# EasyEDA Pro project High Pass Filter.eprj

# Schematic Schematic1
Create Date: 2024-03-29; Page Name: P1; Project Name: High Pass Filter; Schematic Name: Schematic1; Update Date: 2024-03-29; Company: EasyEDA.com; Drawn: EasyEDA; Page Size: A4; Part Number: JLCPCB-002; Reviewed: EasyEDA; Version: V0.1
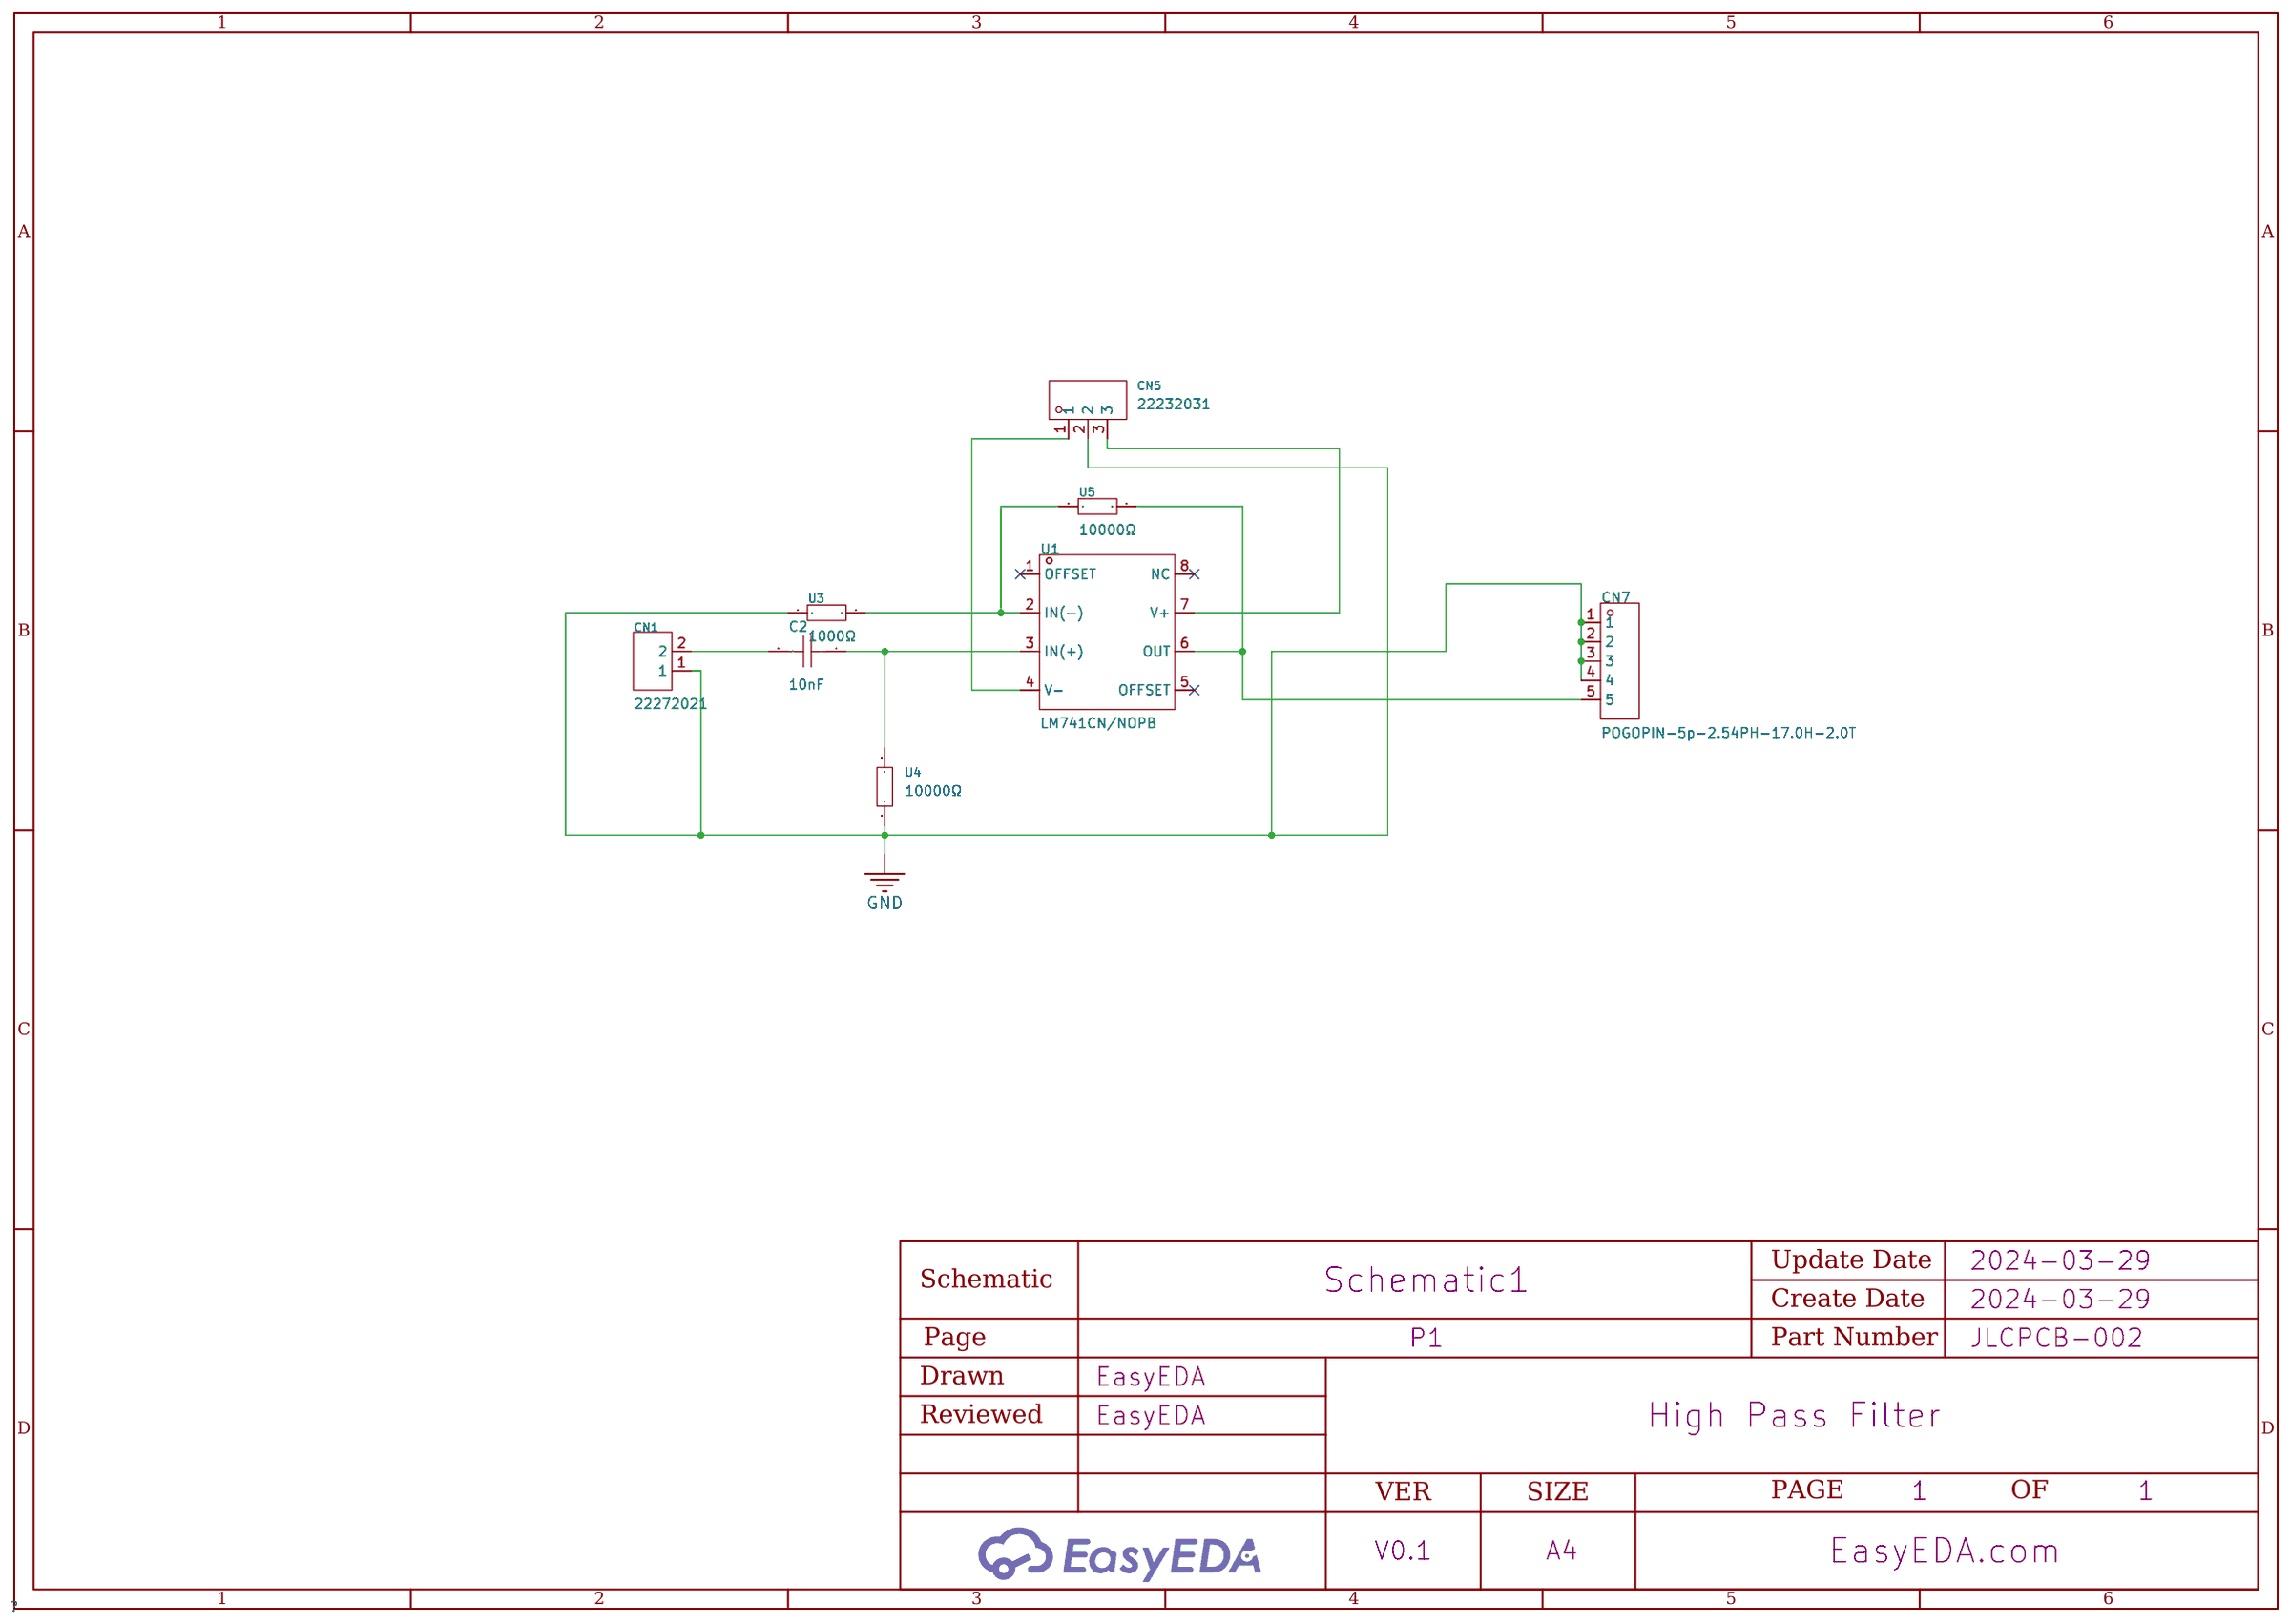
[diagram p0: schematic sheet]

## Parts
C2  10nF  [C0603]
CN1  22272021  [CONN-TH_22272021]
CN5  22232031  [CONN-TH_3P-P2.54_22-23-2031]
CN7  POGOPIN-5p-2.54PH-17.0H-2.0T  [CONN-TH_5P-P2.54_POGOPIN-5P-2.54P]
U1  LM741CN/NOPB  [DIP-8_L9.8-W6.6-P2.54-LS7.6-BL]
U3  1000Ω  [RES-TH_BD3.5-L9.0-P13.00-D0.8]
U4  10000Ω  [RES-TH_BD3.5-L9.0-P13.00-D0.8]
U5  10000Ω  [RES-TH_BD3.5-L9.0-P13.00-D0.8]

## Library data of the parts
C2 = CAP_0603: Supplier Footprint: 0603
CN1 = 22272021: Pins Structure:1x2P Pitch:2.54mm Mounting Style:- Reference Series:- Number of Pins:2P Number of Rows:1 Number of PINs Per Row:2 Row Spacing:- Contact Material:Brass; Supplier Part: C293316; Manufacturer: MOLEX; Supplier Footprint: 插件,P=2.54mm; JLCPCB Part Class: Extended Part; Datasheet: https://atta.szlcsc.com/upload/public/pdf/source/20191223/C471416_BE98D00507934E9FC983B4A2C0217E79.pdf; Supplier: LCSC; Pins Structure: 1x2P; Pitch: 2.54mm; Number of Pins: 2P; Number of Rows: 1; Number of PINs Per Row: 2; Contact Material: Brass
CN5 = 22232031: Pins Structure:1x3P Pitch:2.54mm Mounting Style:- Reference Series:- Number of Pins:3P Number of Rows:1 Number of PINs Per Row:3 Row Spacing:- Contact Material:Brass; LCSC Part Name: 1x3P 间距:2.54mm; Supplier Part: C234181; Manufacturer: MOLEX; Supplier Footprint: 插件,P=2.54mm; JLCPCB Part Class: Extended Part; Datasheet: https://atta.szlcsc.com/upload/public/pdf/source/20200109/C114123_E56320BB7CC6463DA76851D6284C5DE6.pdf; Supplier: LCSC; Pins Structure: 1x3P; Pitch: 2.54mm; Number of Pins: 3P; Number of Rows: 1; Number of PINs Per Row: 3; Contact Material: Brass
CN7 = POGOPIN-5p-2.54PH-17.0H-2.0T: Supplier Part: C9900021779; Supplier Footprint: 5p-2.54PH-17.0H-2.0T; JLCPCB Part Class: Extended Part; Supplier: LCSC
U1 = LM741CN/NOPB: Number of Circuits:单路 Gain Bandwidth Product(GBP):1.5MHz Current - Input Bias(Ib):80nA Slew Rate(SR):0.5V/us Output Current:25mA -3db Bandwidth:- Supply Current:1.5mA Operating Temperature:0℃~+70℃ Operating Temperature:0℃~+70℃; Supplier Part: C13974; Manufacturer: TI(德州仪器); Supplier Footprint: DIP-8; JLCPCB Part Class: Extended Part; Datasheet: https://www.ti.com/cn/lit/gpn/lm741; Supplier: LCSC; Number of Circuits: 单路; Gain Bandwidth Product(GBP): 1.5MHz; Current - Input Bias(Ib): 80nA; Slew Rate(SR): 0.5V/us; Output Current: 25mA; Supply Current: 1.5mA; Operating Temperature: 0℃~+70℃
U3-U5 = FR1WS-5.1Ω±5%: Type:Safety Resistor Resistance: Tolerance:±5% Tolerance:±5% Power(Watts):1W; LCSC Part Name: 5.1Ω ±5% 1W 保险电阻; Supplier Part: C145949; Manufacturer: CCO(千志电子); Supplier Footprint: 插件; JLCPCB Part Class: Extended Part; Datasheet: https://atta.szlcsc.com/upload/public/pdf/source/20171116/C145952_15108222006741123857.pdf; Supplier: LCSC; Type: Safety Resistor; Tolerance: ±5%; Power(Watts): 1W

## Nets
GND: CN1.1 CN5.2 CN7.1 CN7.2 CN7.3 CN7.4 U3.1 U4.1
$1N1586: C2.2 CN1.2
$1N1699: C2.1 U1.3(IN(+)) U4.2
$1N1709: CN5.1 U1.4(V-)
$1N1747: CN5.3 U1.7(V+)
$1N1782: U1.2(IN(-)) U3.2 U5.1
$1N2183: CN7.5 U1.6(OUT) U5.2

Not connected (* = marked no-connect by the designer): U1 1(OFFSET)* 5(OFFSET)* 8(NC)*

# Board PCB1
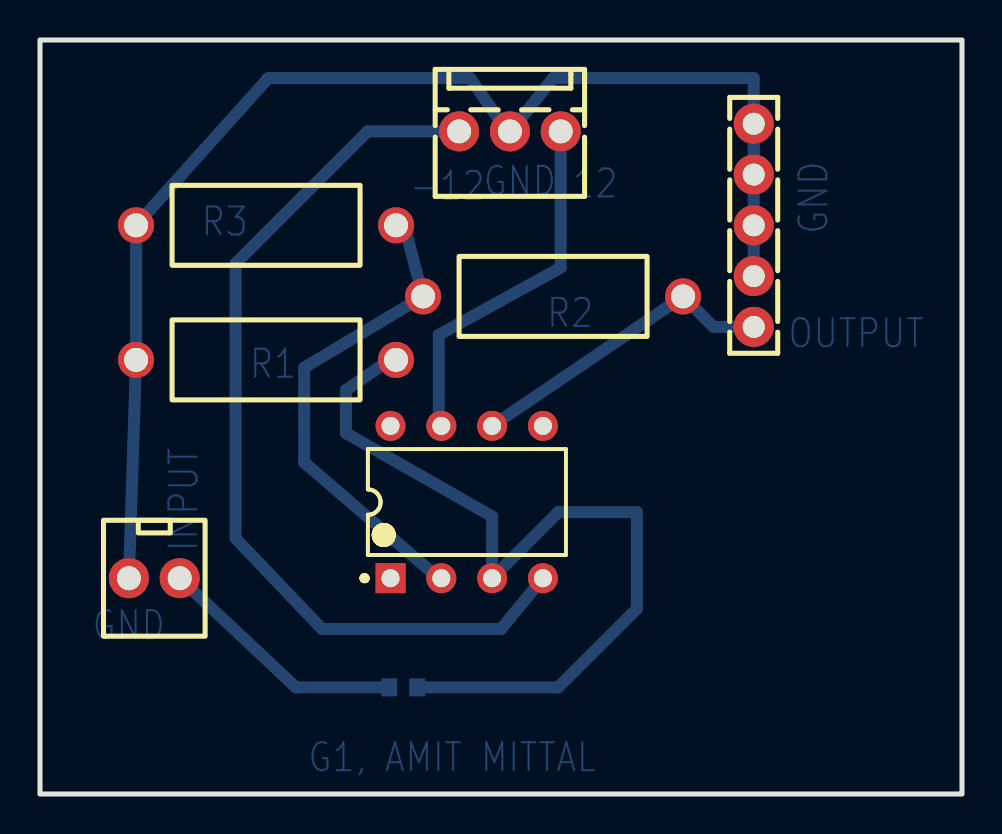
[diagram p1: board, top side]
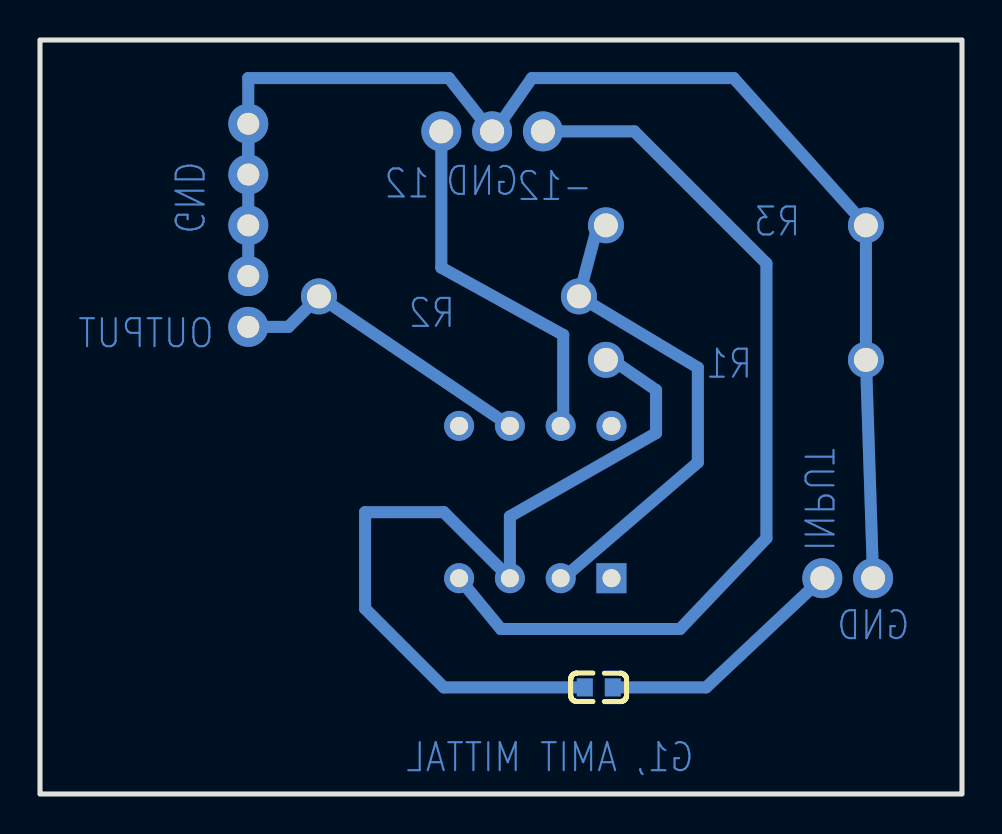
[diagram p2: board, bottom side, seen from below]

Outline 46.1 x 37.72 mm; copper layers: Top Layer, Bottom Layer. Coordinates in mm from the lower left corner of the outline.
Outline path: rectangle 0,37.72 46.1,0
Stack: Top Layer 0.035mm / Dielectric1 1.51mm FR4 er 4.5 / Bottom Layer 0.035mm

## Design rules (mm)
template: JLCPCB Capability(Two Layers Board)
spacing copperThickness1oz (default): track to track 0.102, other pairs 0.152 to 0.3
spacing copperThickness2oz: track to track 0.203, other pairs 0.152 to 0.3
track width copperThickness1oz (default): min 0.127, default 0.254, max 2.54
track width copperThickness2oz: min 0.203, default 0.254, max 2.54
differential pair differentialPair (default): width min 0.127, default 0.254, max 2.54; gap min 0.152, default 0.152
via viaSize (default): diameter min 0.5, default 0.61, max 10; hole min 0.3, default 0.305, max 6.3

## Placement (name value [footprint] x y rotation side)
C2  10nF  [C0603]  18.16 5.33 180 bottom
CN1  22272021  [CONN-TH_22272021]  5.72 10.79 0 top
CN5  22232031  [CONN-TH_3P-P2.54_22-23-2031]  23.5 33.15 0 top
CN7  POGOPIN-5p-2.54PH-17.0H-2.0T  [CONN-TH_5P-P2.54_POGOPIN-5P-2.54P]  35.69 28.45 270 top
U1  LM741CN/NOPB  [DIP-8_L9.8-W6.6-P2.54-LS7.6-BL]  21.34 14.6 0 top
U3  1000Ω  [RES-TH_BD3.5-L9.0-P13.00-D0.8]  11.3 28.45 0 top
U4  10000Ω  [RES-TH_BD3.5-L9.0-P13.00-D0.8]  11.3 21.72 0 top
U5  10000Ω  [RES-TH_BD3.5-L9.0-P13.00-D0.8]  25.65 24.89 0 top

## Footprints (pads in the part's own frame, mm; a bottom-side part is the same pattern mirrored in y, then rotated)
C0603
  rect 0.8x0.9 smd: 1(-0.7,0) 2(0.7,0)
CONN-TH_3P-P2.54_22-23-2031
  round 2 hole 1.2: 1(-2.54,0) 2(0,0) 3(2.54,0)
CONN-TH_5P-P2.54_POGOPIN-5P-2.54P
  round 2 hole 1.1: 1(-5.08,0) 2(-2.54,0) 3(0,0) 4(2.54,0) 5(5.08,0)
CONN-TH_22272021
  round 2 hole 1.2: 1(-1.27,0) 2(1.27,0)
DIP-8_L9.8-W6.6-P2.54-LS7.6-BL
  rect 1.5x1.5 hole 0.9: 1(-3.81,-3.81)
  round 1.5 hole 0.9: 2(-1.27,-3.81) 3(1.27,-3.81) 4(3.81,-3.81) 5(3.81,3.81) 6(1.27,3.81) 7(-1.27,3.81) 8(-3.81,3.81)
RES-TH_BD3.5-L9.0-P13.00-D0.8
  round 1.8 hole 1.2: 1(-6.5,0) 2(6.5,0)

## Nets
As in the schematic.

Pads without a net: U1 1 5 8

## Routing (per net, layer and track width the routed paths; a pad name or vN(x,y) marks a point on that pad's centre or on a via; arc(x,y) is an arc through that point)
GND: length 67.5
  Bottom Layer w0.6: CN1.1 U4.1 U3.1 11.42,35.81 21.5,35.81 23.37,33.15 23.48,33.04 23.48,33.05 25.65,35.81 35.69,35.81 35.69,30.94 ; 35.69,33.4 35.69,25.53 35.81,25.4
$1N1586: length 12.6
  Bottom Layer w0.6: CN1.2 12.8,5.33 C2.2
$1N1699: length 42.6
  Bottom Layer w0.6: 17.68,21.84 15.3,20.21 15.3,18.05 22.61,13.88 U1.3 25.91,14.1 29.84,14.1 29.84,9.27 25.91,5.33 C2.1
$1N1709: length 46.2
  Bottom Layer w0.6: CN5.1 16.38,33.15 9.78,26.54 9.78,12.79 14.1,8.25 23.06,8.25 U1.4
$1N1747: length 18.4
  Bottom Layer w0.6: U1.7 20.07,18.54 19.94,18.67 19.94,22.97 26.03,26.33 CN5.3
$1N1782: length 24.5
  Bottom Layer w0.6: 19.94,10.79 13.21,16.59 13.21,21.33 U5.1 18.27,28.24 U3.2
$1N2183: length 15.8
  Bottom Layer w0.6: U1.6 U5.2 33.68,23.37 CN7.5 35.58,23.37

## Text on the board
Bottom Layer: GND | R3 | R1 | G1, AMIT MITTAL | -12 | R2 | 12 | OUTPUT | INPUT
